# EAGLE design MainPCB_E (EAGLE 9.6.2)
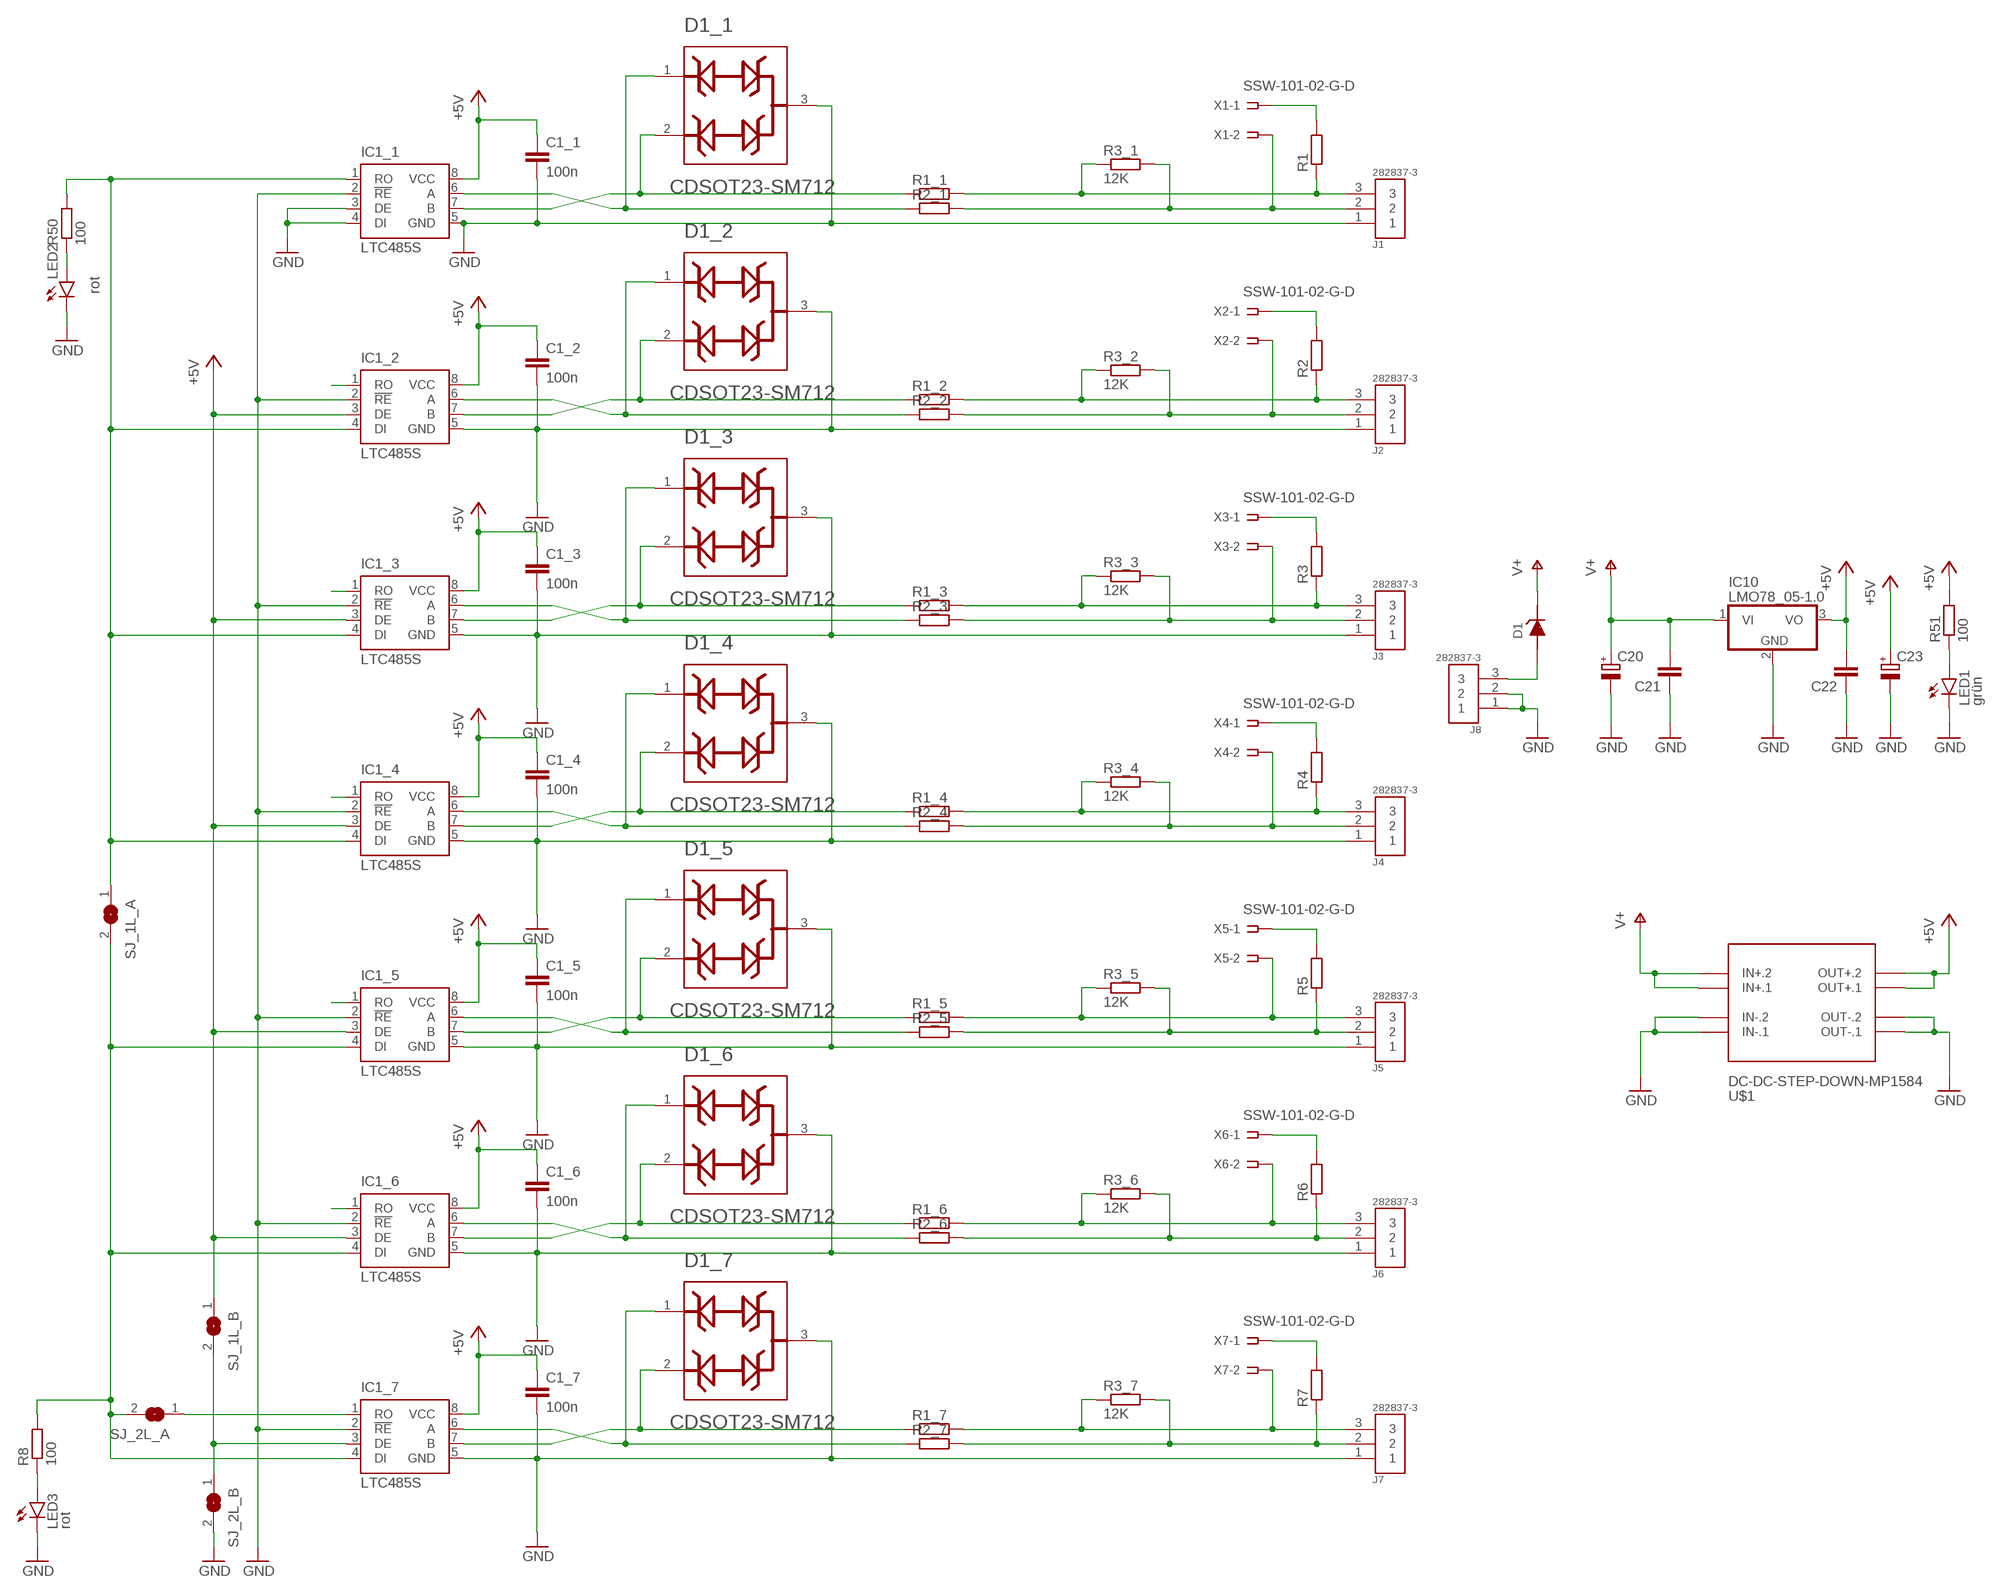
[diagram p0: schematic, sheet 1]

## Parts
C1_1  100n  C-EUC0603K  [C0603K]
C1_2  100n  C-EUC0603K  [C0603K]
C1_3  100n  C-EUC0603K  [C0603K]
C1_4  100n  C-EUC0603K  [C0603K]
C1_5  100n  C-EUC0603K  [C0603K]
C1_6  100n  C-EUC0603K  [C0603K]
C1_7  100n  C-EUC0603K  [C0603K]
C20  CPOL-EUE5-8.5  [E5-8,5]
C21  C-EUC0805K  [C0805K]
C22  C-EUC0805K  [C0805K]
C23  CPOL-EUE5-8.5  [E5-8,5]
D1  ZMM  [MINIMELF]
D1_1  BOURNS_INC._CDSOT23-SM712BOURNS_INC._CDSOT23-SM712_0_1  [BOURNS_INC._CDSOT23-SM712_1]
D1_2  BOURNS_INC._CDSOT23-SM712BOURNS_INC._CDSOT23-SM712_0_1  [BOURNS_INC._CDSOT23-SM712_1]
D1_3  BOURNS_INC._CDSOT23-SM712BOURNS_INC._CDSOT23-SM712_0_1  [BOURNS_INC._CDSOT23-SM712_1]
D1_4  BOURNS_INC._CDSOT23-SM712BOURNS_INC._CDSOT23-SM712_0_1  [BOURNS_INC._CDSOT23-SM712_1]
D1_5  BOURNS_INC._CDSOT23-SM712BOURNS_INC._CDSOT23-SM712_0_1  [BOURNS_INC._CDSOT23-SM712_1]
D1_6  BOURNS_INC._CDSOT23-SM712BOURNS_INC._CDSOT23-SM712_0_1  [BOURNS_INC._CDSOT23-SM712_1]
D1_7  BOURNS_INC._CDSOT23-SM712BOURNS_INC._CDSOT23-SM712_0_1  [BOURNS_INC._CDSOT23-SM712_1]
IC1_1  LTC485S  [SOIC8]
IC1_2  LTC485S  [SOIC8]
IC1_3  LTC485S  [SOIC8]
IC1_4  LTC485S  [SOIC8]
IC1_5  LTC485S  [SOIC8]
IC1_6  LTC485S  [SOIC8]
IC1_7  LTC485S  [SOIC8]
IC10  LMO78_05-1.0  7815TV  [TO220V]
J1  282837-3  [TE_282837-3]
J2  282837-3  [TE_282837-3]
J3  282837-3  [TE_282837-3]
J4  282837-3  [TE_282837-3]
J5  282837-3  [TE_282837-3]
J6  282837-3  [TE_282837-3]
J7  282837-3  [TE_282837-3]
J8  282837-3  [TE_282837-3]
LED1  grün  LED5MM  [LED5MM]
LED2  rot  LED5MM  [LED5MM]
LED3  rot  LED5MM  [LED5MM]
R1  R-EU_R1206  [R1206]
R1_1  R-EU_R0805  [R0805]
R1_2  R-EU_R0805  [R0805]
R1_3  R-EU_R0805  [R0805]
R1_4  R-EU_R0805  [R0805]
R1_5  R-EU_R0805  [R0805]
R1_6  R-EU_R0805  [R0805]
R1_7  R-EU_R0805  [R0805]
R2  R-EU_R1206  [R1206]
R2_1  R-EU_R0805  [R0805]
R2_2  R-EU_R0805  [R0805]
R2_3  R-EU_R0805  [R0805]
R2_4  R-EU_R0805  [R0805]
R2_5  R-EU_R0805  [R0805]
R2_6  R-EU_R0805  [R0805]
R2_7  R-EU_R0805  [R0805]
R3  R-EU_R1206  [R1206]
R3_1  12K  R-EU_R0603  [R0603]
R3_2  12K  R-EU_R0603  [R0603]
R3_3  12K  R-EU_R0603  [R0603]
R3_4  12K  R-EU_R0603  [R0603]
R3_5  12K  R-EU_R0603  [R0603]
R3_6  12K  R-EU_R0603  [R0603]
R3_7  12K  R-EU_R0603  [R0603]
R4  R-EU_R1206  [R1206]
R5  R-EU_R1206  [R1206]
R6  R-EU_R1206  [R1206]
R7  R-EU_R1206  [R1206]
R8  100  R-EU_R0603  [R0603]
R50  100  R-EU_R0603  [R0603]
R51  100  R-EU_R0603  [R0603]
SJ_1L_A  SJ  [SJ]
SJ_1L_B  SJ  [SJ]
SJ_2L_A  SJ  [SJ]
SJ_2L_B  SJ  [SJ]
U$1  DC-DC-STEP-DOWN-MP1584  [DC-DC-STEP-DOWN-MP1584]
X1  SSW-101-02-G-D  [SSW-101-02-G-D]
X2  SSW-101-02-G-D  [SSW-101-02-G-D]
X3  SSW-101-02-G-D  [SSW-101-02-G-D]
X4  SSW-101-02-G-D  [SSW-101-02-G-D]
X5  SSW-101-02-G-D  [SSW-101-02-G-D]
X6  SSW-101-02-G-D  [SSW-101-02-G-D]
X7  SSW-101-02-G-D  [SSW-101-02-G-D]

## Nets
+5V: C1_1.1 C1_2.1 C1_3.1 C1_4.1 C1_5.1 C1_6.1 C1_7.1 C22.2 C23.+ IC1_1.8(VCC) IC1_2.3(DE) IC1_2.8(VCC) IC1_3.3(DE) IC1_3.8(VCC) IC1_4.3(DE) IC1_4.8(VCC) IC1_5.3(DE) IC1_5.8(VCC) IC1_6.3(DE) IC1_6.8(VCC) IC1_7.8(VCC) IC10.3(VO) R51.2 SJ_1L_B.1 U$1.OUT+.1 U$1.OUT+.2
GND: C1_1.2 C1_2.2 C1_3.2 C1_4.2 C1_5.2 C1_6.2 C1_7.2 C20.- C21.1 C22.1 C23.- D1_1.3 D1_2.3 D1_3.3 D1_4.3 D1_5.3 D1_6.3 D1_7.3 IC1_1.2(!RE) IC1_1.3(DE) IC1_1.4(DI) IC1_1.5(GND) IC1_2.2(!RE) IC1_2.5(GND) IC1_3.2(!RE) IC1_3.5(GND) IC1_4.2(!RE) IC1_4.5(GND) IC1_5.2(!RE) IC1_5.5(GND) IC1_6.2(!RE) IC1_6.5(GND) IC1_7.2(!RE) IC1_7.5(GND) IC10.2(GND) J1.1 J2.1 J3.1 J4.1 J5.1 J6.1 J7.1 J8.1 J8.2 LED1.K(C) LED2.K(C) LED3.K(C) SJ_2L_B.2 U$1.IN-.1 U$1.IN-.2 U$1.OUT-.1 U$1.OUT-.2
N$1: R7.2 X7.1
N$2: R6.2 X6.1
N$3: LED3.A R8.1
N$4: R5.2 X5.1
N$5: D1_1.2 IC1_1.7(B) R1_1.1
N$6: IC1_7.3(DE) SJ_1L_B.2 SJ_2L_B.1
N$7: IC1_1.1(RO) IC1_2.4(DI) IC1_3.4(DI) IC1_4.4(DI) R50.2 SJ_1L_A.1
N$8: J1.3 R1.1 R1_1.2 R3_1.1
N$9: J1.2 R2_1.2 R3_1.2 X1.2
N$10: D1_1.1 IC1_1.6(A) R2_1.1
N$11: R4.2 X4.1
N$12: R3.2 X3.1
N$13: R2.2 X2.1
N$14: D1_2.2 IC1_2.7(B) R1_2.1
N$15: IC1_2.1(RO)
N$16: J2.3 R1_2.2 R2.1 R3_2.1
N$17: J2.2 R2_2.2 R3_2.2 X2.2
N$18: IC1_7.1(RO) SJ_2L_A.1
N$19: D1_2.1 IC1_2.6(A) R2_2.1
N$20: R1.2 X1.1
N$21: D1_3.2 IC1_3.7(B) R1_3.1
N$22: IC1_3.1(RO)
N$23: J3.3 R1_3.2 R3.1 R3_3.1
N$24: J3.2 R2_3.2 R3_3.2 X3.2
N$25: D1_3.1 IC1_3.6(A) R2_3.1
N$26: J4.3 R1_4.2 R3_4.1 R4.1
N$27: J4.2 R2_4.2 R3_4.2 X4.2
N$28: IC1_5.4(DI) IC1_6.4(DI) IC1_7.4(DI) R8.2 SJ_1L_A.2 SJ_2L_A.2
N$29: J5.3 R1_5.2 R3_5.1 X5.2
N$30: J5.2 R2_5.2 R3_5.2 R5.1
N$31: J6.3 R1_6.2 R3_6.1 X6.2
N$32: J6.2 R2_6.2 R3_6.2 R6.1
N$33: J7.3 R1_7.2 R3_7.1 X7.2
N$34: J7.2 R2_7.2 R3_7.2 R7.1
N$35: D1_5.2 IC1_5.7(B) R1_5.1
N$36: IC1_5.1(RO)
N$37: D1.A J8.3
N$39: LED1.A R51.1
N$40: LED2.A R50.1
N$41: D1_5.1 IC1_5.6(A) R2_5.1
N$43: D1_6.2 IC1_6.7(B) R1_6.1
N$44: IC1_6.1(RO)
N$47: D1_6.1 IC1_6.6(A) R2_6.1
N$55: D1_4.2 IC1_4.7(B) R1_4.1
N$56: IC1_4.1(RO)
N$59: D1_4.1 IC1_4.6(A) R2_4.1
N$67: D1_7.2 IC1_7.7(B) R1_7.1
N$71: D1_7.1 IC1_7.6(A) R2_7.1
V+: C20.+ C21.2 D1.C(K) IC10.1(VI) U$1.IN+.1 U$1.IN+.2

## Library data of the parts
C1_1-C1_7 C21 C22 = rcl:C-EU: CAPACITOR, European symbol; SPICEPREFIX: C
C20 C23 = rcl:CPOL-EU: POLARIZED CAPACITOR, European symbol; SPICEPREFIX: C
D1 = ct_Discrete:ZMM: Zener Diode, Minimelf
D1_1-D1_7 = Bourns Inc. - CDSOT23-SM712:BOURNS_INC._CDSOT23-SM712: 26V, 14V Clamp 17A (8/20µs) Ipp Tvs Diode Surface Mount SOT-23-3; AUTOMOTIVE: No; BREAKDOWN_VOLTAGE: 7.5V; CAPACITANCE: 75pF; CENTROID_NOT_SPECIFIED: No; CLAMPING_VOLTAGE: 26V; DATASHEET: https://www.bourns.com/docs/Product-Datasheets/CDSOT23-SM712.pdf; DEVICE_CLASS_L1: Circuit Protection; DEVICE_CLASS_L2: TVS Diodes; DEVICE_CLASS_L3: unset; DIGIKEY_DESCRIPTION: DIODE TVS DIODE 7V/12V 14V/26V SOT23-3; DIGIKEY_PART_NUMBER: CDSOT23-SM712CT-ND; DIRECTION: Bidirectional; FOOTPRINT_PARAMETERS_1: {"fp_type":"SOT23","params":{"N":{"default":"3","long name":"Number of leads","type":"multichoice","short name":"N"},"A":{"nom":false,"long name":"Height","min":890000,"max":1170000,"short name":"A","type":"measurement"},"A1":{"nom":false,"long name":"Package clearance","min":50000,"max":150000,"short name":"A1","type":"measurement"},"A2":{"nom":false,"long name":"Package height","min":false,"max":1120000,"short name":"A2","type":"measurement"},"D":{"nom":false,"long name":"Package length","min":2800000,"max":3000000,"short name":"D","type":"measurement"},"E":{"nom":false,"long name":"Width /w leads","min":2100000,"max":2490000,"short name":"E","type":"measurement"},"E1":{"nom":false,"long name":"Package width","min":1200000,"max":1400000,"short name":"E1","type":"measurement"},"B":{"nom":false,"long name":"Lead width","min":300000,"max":500000,"short name":"B","type":"measurement"},"C":{"nom":false,"long name":"Lead thickness","min":80000,"max":200000,"short name":"C","type":"measurement"},"L":{"nom":false,"long name":"Lead foot length","min":400000,"max":580000,"short name":"L","type":"measurement"},"e":{"nom":950000,"long name":"Lead pitch","min":null,"max":null,"short name":"e","type":"measurement"},"PHI":{"nom":false,"long name":"Lead angle","min":0,"max":8,"short name":"PHI","type":"measurement"},"offset x":{"nom":0,"long name":"X Center offset","min":null,"max":null,"short name":"offset x","type":"measurement"},"offset y":{"nom":0,"long name":"Y Center offset","min":null,"max":null,"short name":"offset y","type":"measurement"},"LS":{"default":"Rounded rectangle","long name":"Land shape","type":"multichoice","short name":"LS"},"LS1":{"default":"Rectangle","long name":"Land shape (Pin 1)","type":"multichoice","short name":"LS1"},"solder toe":{"nom":550000,"long name":"Solder fillet (toe)","min":null,"max":null,"short name":"solder toe","type":"fixedmeasurement"},"solder heel":{"nom":450000,"long name":"Solder fillet (heel)","min":null,"max":null,"short name":"solder heel","type":"fixedmeasurement"},"solder side":{"nom":50000,"long name":"Solder fillet (side)","min":null,"max":null,"short name":"solder side","type":"fixedmeasurement"},"courtyard":{"nom":500000,"long name":"Courtyard","min":null,"max":null,"short name":"courtyard","type":"fixedmeasurement"},"SF":{"default":"A","long name":"Packing level","type":"multichoiceparent","short name":"SF","help":"http://support.upverter.com/customer/portal/articles/978783-what-is-a-footprint-packing-level","children":["solder toe","solder heel","solder side","courtyard"]}}}; FOOTPRINT_PARAMETERS_2: {"fp_type":"SOT23","params":{"N":{"default":"3","long name":"Number of leads","type":"multichoice","short name":"N"},"A":{"nom":false,"long name":"Height","min":890000,"max":1170000,"short name":"A","type":"measurement"},"A1":{"nom":false,"long name":"Package clearance","min":50000,"max":150000,"short name":"A1","type":"measurement"},"A2":{"nom":false,"long name":"Package height","min":false,"max":1120000,"short name":"A2","type":"measurement"},"D":{"nom":false,"long name":"Package length","min":2800000,"max":3000000,"short name":"D","type":"measurement"},"E":{"nom":false,"long name":"Width /w leads","min":2100000,"max":2490000,"short name":"E","type":"measurement"},"E1":{"nom":false,"long name":"Package width","min":1200000,"max":1400000,"short name":"E1","type":"measurement"},"B":{"nom":false,"long name":"Lead width","min":300000,"max":500000,"short name":"B","type":"measurement"},"C":{"nom":false,"long name":"Lead thickness","min":80000,"max":200000,"short name":"C","type":"measurement"},"L":{"nom":false,"long name":"Lead foot length","min":400000,"max":580000,"short name":"L","type":"measurement"},"e":{"nom":950000,"long name":"Lead pitch","min":null,"max":null,"short name":"e","type":"measurement"},"PHI":{"nom":false,"long name":"Lead angle","min":0,"max":8,"short name":"PHI","type":"measurement"},"offset x":{"nom":0,"long name":"X Center offset","min":null,"max":null,"short name":"offset x","type":"measurement"},"offset y":{"nom":0,"long name":"Y Center offset","min":null,"max":null,"short name":"offset y","type":"measurement"},"LS":{"default":"Rounded rectangle","long name":"Land shape","type":"multichoice","short name":"LS"},"LS1":{"default":"Rectangle","long name":"Land shape (Pin 1)","type":"multichoice","short name":"LS1"},"solder toe":{"nom":350000,"long name":"Solder fillet (toe)","min":null,"max":null,"short name":"solder toe","type":"fixedmeasurement"},"solder heel":{"nom":350000,"long name":"Solder fillet (heel)","min":null,"max":null,"short name":"solder heel","type":"fixedmeasurement"},"solder side":{"nom":30000,"long name":"Solder fillet (side)","min":null,"max":null,"short name":"solder side","type":"fixedmeasurement"},"courtyard":{"nom":250000,"long name":"Courtyard","min":null,"max":null,"short name":"courtyard","type":"fixedmeasurement"},"SF":{"default":"B","long name":"Packing level","type":"multichoiceparent","short name":"SF","help":"http://support.upverter.com/customer/portal/articles/978783-what-is-a-footprint-packing-level","children":["solder toe","solder heel","solder side","courtyard"]}}}; FOOTPRINT_PARAMETERS_3: {"fp_type":"SOT23","params":{"N":{"default":"3","long name":"Number of leads","type":"multichoice","short name":"N"},"A":{"nom":false,"long name":"Height","min":890000,"max":1170000,"short name":"A","type":"measurement"},"A1":{"nom":false,"long name":"Package clearance","min":50000,"max":150000,"short name":"A1","type":"measurement"},"A2":{"nom":false,"long name":"Package height","min":false,"max":1120000,"short name":"A2","type":"measurement"},"D":{"nom":false,"long name":"Package length","min":2800000,"max":3000000,"short name":"D","type":"measurement"},"E":{"nom":false,"long name":"Width /w leads","min":2100000,"max":2490000,"short name":"E","type":"measurement"},"E1":{"nom":false,"long name":"Package width","min":1200000,"max":1400000,"short name":"E1","type":"measurement"},"B":{"nom":false,"long name":"Lead width","min":300000,"max":500000,"short name":"B","type":"measurement"},"C":{"nom":false,"long name":"Lead thickness","min":80000,"max":200000,"short name":"C","type":"measurement"},"L":{"nom":false,"long name":"Lead foot length","min":400000,"max":580000,"short name":"L","type":"measurement"},"e":{"nom":950000,"long name":"Lead pitch","min":null,"max":null,"short name":"e","type":"measurement"},"PHI":{"nom":false,"long name":"Lead angle","min":0,"max":8,"short name":"PHI","type":"measurement"},"offset x":{"nom":0,"long name":"X Center offset","min":null,"max":null,"short name":"offset x","type":"measurement"},"offset y":{"nom":0,"long name":"Y Center offset","min":null,"max":null,"short name":"offset y","type":"measurement"},"LS":{"default":"Rounded rectangle","long name":"Land shape","type":"multichoice","short name":"LS"},"LS1":{"default":"Rectangle","long name":"Land shape (Pin 1)","type":"multichoice","short name":"LS1"},"solder toe":{"nom":150000,"long name":"Solder fillet (toe)","min":null,"max":null,"short name":"solder toe","type":"fixedmeasurement"},"solder heel":{"nom":250000,"long name":"Solder fillet (heel)","min":null,"max":null,"short name":"solder heel","type":"fixedmeasurement"},"solder side":{"nom":10000,"long name":"Solder fillet (side)","min":null,"max":null,"short name":"solder side","type":"fixedmeasurement"},"courtyard":{"nom":100000,"long name":"Courtyard","min":null,"max":null,"short name":"courtyard","type":"fixedmeasurement"},"SF":{"default":"C","long name":"Packing level","type":"multichoiceparent","short name":"SF","help":"http://support.upverter.com/customer/portal/articles/978783-what-is-a-footprint-packing-level","children":["solder toe","solder heel","solder side","courtyard"]}}}; FOOTPRINT_VARIANT_NAME_0: Recommended_Land_Pattern; FOOTPRINT_VARIANT_NAME_1: IPC_A; FOOTPRINT_VARIANT_NAME_2: IPC_B; FOOTPRINT_VARIANT_NAME_3: IPC_C; HEIGHT: 1.17mm; IPC_LAND_PATTERN_NAME: SOT95P229X103-3; LEAD_FREE: Yes; MF: Bourns Inc.; MFG_PACKAGE_IDENT: SOT23; MFG_PACKAGE_IDENT_DATE: 0; MFG_PACKAGE_IDENT_REV: 0; MOUSER_DESCRIPTION: Transient Voltage Suppressor, TVS, CDSOT23 Series, Unidirectional, 12 V, SOT-23, 3, 13.3 V; MOUSER_PART_NUMBER: 652-CDSOT23-SM712; MPN: CDSOT23-SM712; NUMBER_OF_CHANNELS: 2; PACKAGE: SOT23-3; PEAK_PULSE_CURRENT: 17A; PEAK_PULSE_POWER: 400W; PREFIX: D; REVERSE_STANDOFF_VOLTAGE: 12V; ROHS: Yes; STANDOFF_HEIGHT: 0.05mm; TEMPERATURE_RANGE_HIGH: +150°C; TEMPERATURE_RANGE_LOW: -55°C; VERIFICATION_VERSION: 0.0.0.3
IC1_1-IC1_7 = linear-technology:LTC485: Low Power RS485 Interface Transceiver Source: http://www.linear.com/pc/downloadDocument.do?navId=H0,C1,C1007,C1017,P2064,D1718; OC_FARNELL: unknown; OC_NEWARK: unknown
IC10 = linear:78*: Positive VOLTAGE REGULATOR Source: http://cache.national.com/ds/LM/LM78L05.pdf http://www.fairchildsemi.com/ds/LM/LM7805.pdf
J1-J8 = 282837-3:282837-3: TERMI-BLOK PCB MOUNT 3P; MANUFACTURER: TE CONNECTIVITY; PARTREV: H; STANDARD: Manufacturer Recommendations
LED1-LED3 = led:LED: LED OSRAM: - CHIPLED LG R971, LG N971, LY N971, LG Q971, LY Q971, LO R971, LY R971 LH N974, LH R974 LS Q976, LO Q976, LY Q976 LO Q996 - Hyper CHIPLED LW Q18S LB Q993, LB Q99A, LB R99A - SideLED LS A670, LO A670, LY A670, LG A670, LP A670 LB A673, LV A673, LT A673, LW A673 LH A674 LY A675 LS A676, LA A676, LO A676, LY A676, LW A676 LS A679, LY A679, LG A679 - Hyper Micro SIDELED® LS Y876, LA Y876, LO Y876, LY Y876 LT Y87S - SmartLED LW L88C, LW L88S LB L89C, LB L89S, LG L890 LS L89K, LO L89K, LY L89K LS L896, LA L896, LO L896, LY L896 - TOPLED LS T670, LO T670, LY T670, LG T670, LP T670 LSG T670, LSP T670, LSY T670, LOP T670, LYG T670 LG T671, LOG T671, LSG T671 LB T673, LV T673, LT T673, LW T673 LH T674 LS T676, LA T676, LO T676, LY T676, LB T676, LH T676, LSB T676, LW T676 LB T67C, LV T67C, LT T67C, LS T67K, LO T67K, LY T67K, LW E67C LS E67B, LA E67B, LO E67B, LY E67B, LB E67C, LV E67C, LT E67C LW T67C LS T679, LY T679, LG T679 LS T770, LO T770, LY T770, LG T770, LP T770 LB T773, LV T773, LT T773, LW T773 LH T774 LS E675, LA E675, LY E675, LS T675 LS T776, LA T776, LO T776, LY T776, LB T776 LHGB T686 LT T68C, LB T68C - Hyper Mini TOPLED® LB M676 - Mini TOPLED Santana® LG M470 LS M47K, LO M47K, LY M47K Source: http://www.osram.convergy.de LUXEON: - LUMILED® LXK2-PW12-R00, LXK2-PW12-S00, LXK2-PW14-U00, LXK2-PW14-V00 LXK2-PM12-R00, LXK2-PM12-S00, LXK2-PM14-U00 LXK2-PE12-Q00, LXK2-PE12-R00, LXK2-PE12-S00, LXK2-PE14-T00, LXK2-PE14-U00 LXK2-PB12-K00, LXK2-PB12-L00, LXK2-PB12-M00, LXK2-PB14-N00, LXK2-PB14-P00, LXK2-PB14-Q00 LXK2-PR12-L00, LXK2-PR12-M00, LXK2-PR14-Q00, LXK2-PR14-R00 LXK2-PD12-Q00, LXK2-PD12-R00, LXK2-PD12-S00 LXK2-PH12-R00, LXK2-PH12-S00 LXK2-PL12-P00, LXK2-PL12-Q00, LXK2-PL12-R00 Source: www.luxeon.com KINGBRIGHT: KA-3528ASYC Source: www.kingbright.com
R1 R1_1-R1_7 R2 R2_1-R2_7 R3 R3_1-R3_7 R4-R8 R50 R51 = rcl:R-EU_: RESISTOR, European symbol; SPICEPREFIX: R
SJ_1L_A SJ_1L_B SJ_2L_A SJ_2L_B = jumper:SJ: SMD solder JUMPER
U$1 = diy-modules:DC-DC-STEP-DOWN-MP1584: DC/DC Step-Down Regulator based on MP1584 chip MP1584 datasheet available here: http://www.haoyuelectronics.com/Attachment/MP1584/MP1584.pdf Click here to find device on ebay.com <http://www.ebay.com/sch/mp1584+module>
X1-X7 = con-samtec:SSW-101-02-G: THROUGH-HOLE .025" SQ POST SOCKET Source: Samtec SSW.pdf; MF: Samtec Inc.; MPN: SSW-101-02-G-D; OC_FARNELL: unknown; OC_NEWARK: 82P1456

## Board
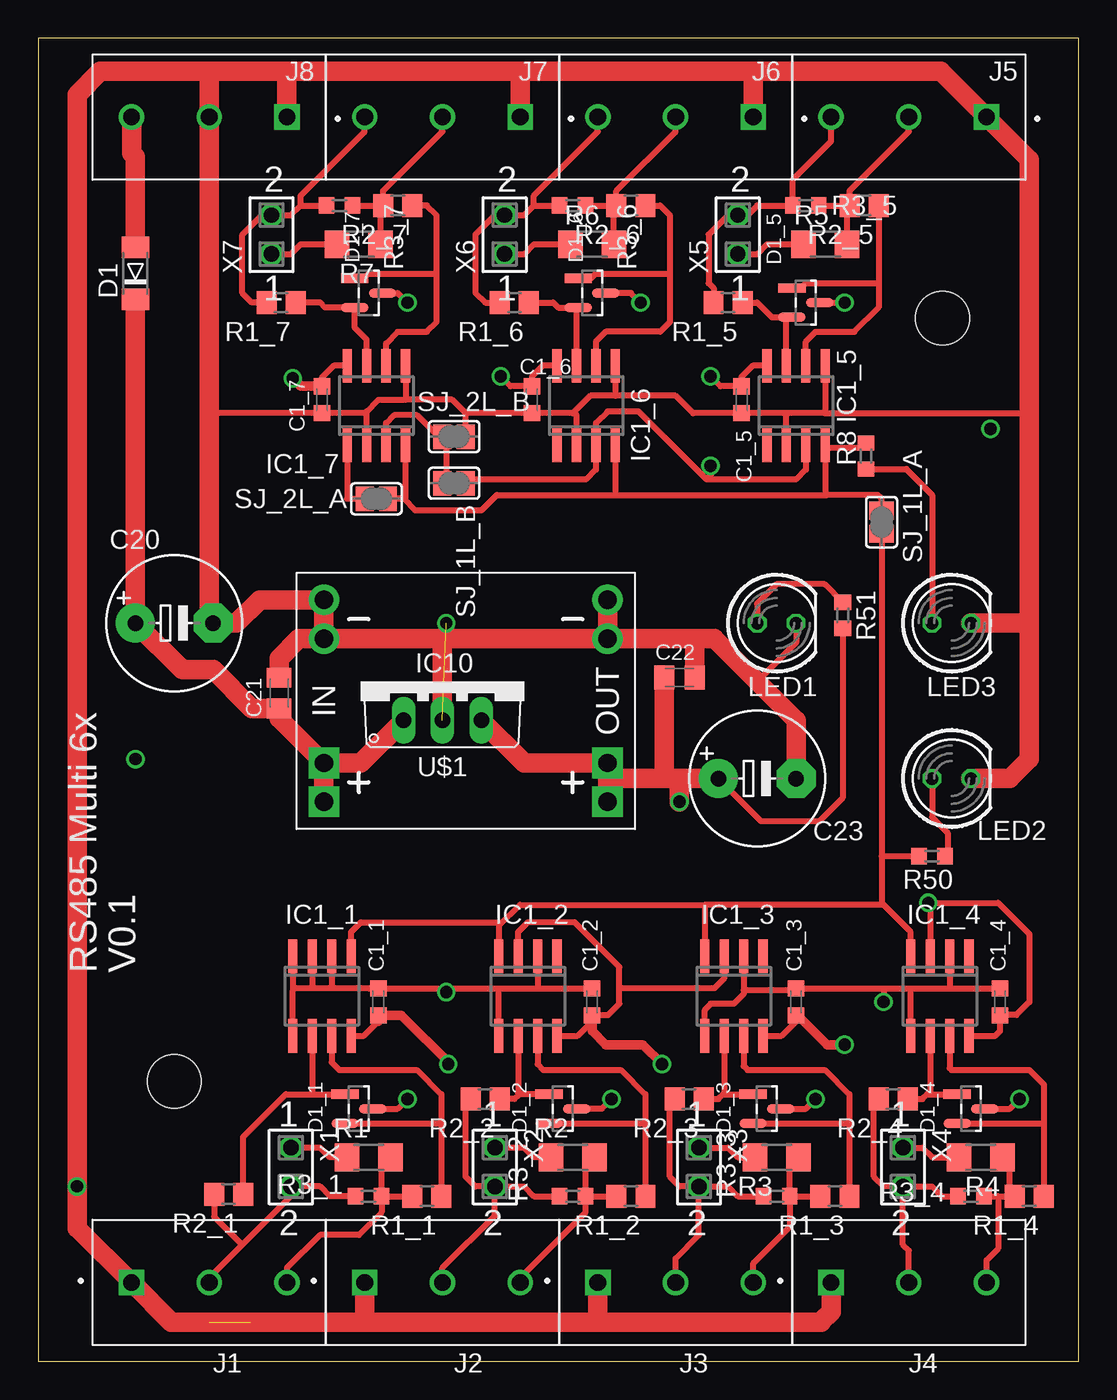
[diagram p1: board, top side]
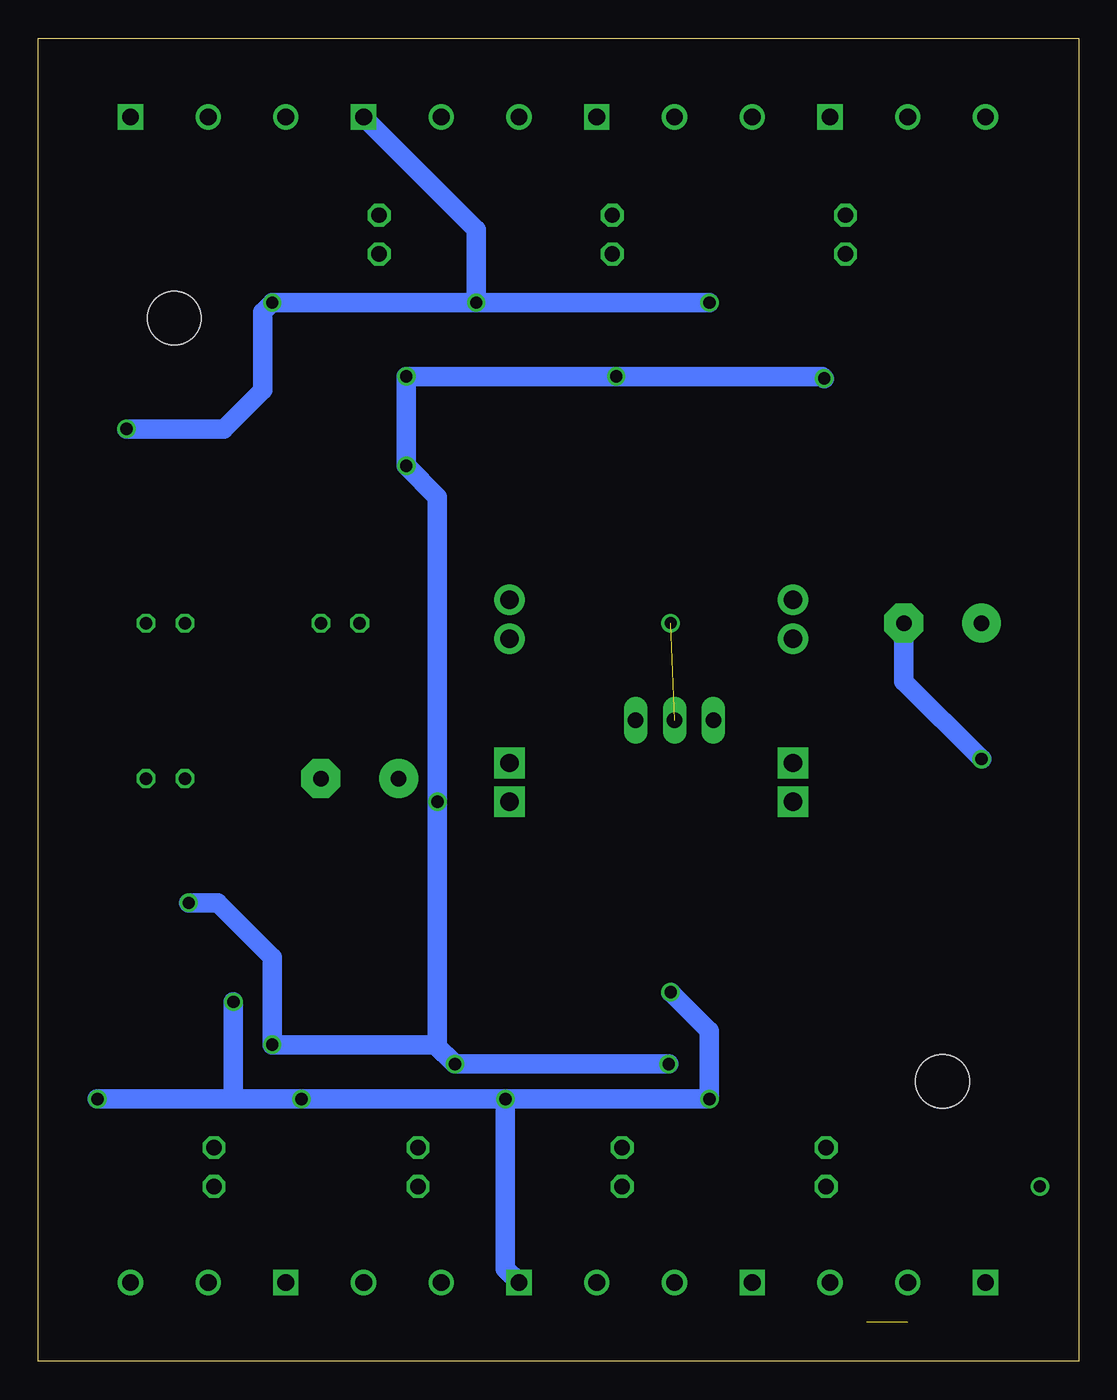
[diagram p2: board, bottom side, seen from below]

Size 68 x 86.5 mm. Coordinates in mm from the lower left corner, seen from the top.
Outline: 0,0 68,0 68,86.5 0,86.5 0,0
Copper layers (1*16): Top 0.018mm / dielectric 1.55mm / Bottom 0.018mm
Design rules "Multi-CB_2L_100µm-Tracks_OL35µm": minimum track width 0.1mm, minimum drill 0.2mm, track to track 0.1mm, track to pad 0.1mm, pad to pad 0.1mm, via to via 0.1mm, smd to smd 0mil, copper to edge 0.2mm, drill to drill 0.2mm, minimum pad ring 0.125mm, minimum via ring 0.1mm, stop-mask expansion 2mil, vias tented up to drill 0.45mm, thermal gap 0.2mm
Holes 3.5 mm at 8.9,18.3 59.1,68.2

### Footprints (pad centres in the part's own frame; a part is rotated, then mirrored left to right if it is on the bottom)
C0603K = smd 1.05 x 1.08: 1 -0.875,0; 2 0.875,0
E5-8,5 = drill 1.016 pad 2.54: + -2.54,0 | drill 1.016 pad 2.54 octagon: - 2.54,0
C0805K = smd 1.3 x 1.6: 1 -1,0; 2 1,0
MINIMELF = smd 1.4 x 1.8: A 1.7,0; C -1.7,0
BOURNS_INC._CDSOT23-SM712_1 = smd 1.781 x 0.612: 1 -0.908,0.95; 2 -0.908,-0.95; 3 0.908,0
SOIC8 = smd 0.6 x 2.2: 1 -1.905,-2.6; 2 -0.635,-2.6; 3 0.635,-2.6; 4 1.905,-2.6; 5 1.905,2.6; 6 0.635,2.6; 7 -0.635,2.6; 8 -1.905,2.6
TO220V = drill 1.016 long: 1 -2.54,-2.54; 2 0,-2.54; 3 2.54,-2.54
TE_282837-3 = drill 1.1 square: 1 -5.08,0 | drill 1.1: 2 0,0; 3 5.08,0
LED5MM = drill 0.813 octagon: A -1.27,0; K 1.27,0
R1206 = smd 1.6 x 1.803: 1 -1.422,0; 2 1.422,0
R0805 = smd 1.3 x 1.5: 1 -0.95,0; 2 0.95,0
R0603 = smd 1 x 1.1: 1 -0.85,0; 2 0.85,0
SJ = smd 1.168 x 1.6: 1 -0.762,0; 2 0.762,0
DC-DC-STEP-DOWN-MP1584 = drill 1.2 pad 2 square: IN+.1 -9.271,-4.064; IN+.2 -9.271,-6.604; OUT+.1 9.271,-4.064; OUT+.2 9.271,-6.604 | drill 1.2 pad 2: IN-.1 -9.271,6.604; IN-.2 -9.271,4.064; OUT-.1 9.271,6.604; OUT-.2 9.271,4.064
SSW-101-02-G-D = drill 1 pad 1.5 octagon: 1 0,-1.27; 2 0,1.27

### Placement (x,y rotation side)
C1_1  22.23,23.5 90 top
C1_2  36.2,23.5 90 top
C1_3  49.53,23.5 90 top
C1_4  62.87,23.5 90 top
C1_5  45.97,62.87 270 top
C1_6  32.26,62.87 270 top
C1_7  18.54,62.87 270 top
C20  8.89,48.26 0 top
C21  15.75,43.69 270 top
C22  41.91,44.7 180 top
C23  46.99,38.1 0 top
D1  6.35,71.12 90 top
D1_1  20.95,16.51 0 top
D1_2  34.29,16.51 0 top
D1_3  47.62,16.51 0 top
D1_4  60.96,16.51 0 top
D1_5  50.16,69.22 0 top
D1_6  36.2,69.85 0 top
D1_7  21.59,69.85 0 top
IC1_1  18.54,23.88 180 top
IC1_2  32,23.88 180 top
IC1_3  45.47,23.88 180 top
IC1_4  58.93,23.88 180 top
IC1_5  49.53,62.48 0 top
IC1_6  35.81,62.48 0 top
IC1_7  22.1,62.48 0 top
IC10  26.42,44.45 0 top
J1  11.18,5.15 0 top
J2  26.42,5.15 0 top
J3  41.66,5.15 0 top
J4  56.9,5.15 0 top
J5  56.9,81.35 180 top
J6  41.66,81.35 180 top
J7  26.42,81.35 180 top
J8  11.18,81.35 180 top
LED1  48.26,48.26 0 top
LED2  59.69,38.1 0 top
LED3  59.69,48.26 0 top
R1  21.59,13.34 180 top
R1_1  25.4,10.79 180 top
R1_2  38.73,10.79 180 top
R1_3  52.07,10.79 180 top
R1_4  64.77,10.79 180 top
R1_5  45.09,69.22 180 top
R1_6  31.11,69.22 180 top
R1_7  15.88,69.22 180 top
R2  34.92,13.34 180 top
R2_1  12.45,10.92 180 top
R2_2  29.21,17.14 180 top
R2_3  42.55,17.14 180 top
R2_4  55.88,17.14 180 top
R2_5  53.98,75.56 180 top
R2_6  38.73,75.56 180 top
R2_7  23.5,75.56 180 top
R3  48.26,13.34 180 top
R3_1  21.59,10.79 180 top
R3_2  34.92,10.79 180 top
R3_3  48.26,10.79 180 top
R3_4  60.96,10.79 180 top
R3_5  50.16,75.56 0 top
R3_6  34.92,75.56 0 top
R3_7  19.68,75.56 0 top
R4  61.59,13.34 180 top
R5  51.44,73.03 180 top
R6  36.2,73.03 180 top
R7  20.95,73.03 180 top
R8  54.1,59.18 90 top
R50  58.42,33.02 180 top
R51  52.58,48.77 270 top
SJ_1L_A  55.12,54.86 90 top
SJ_1L_B  27.18,57.4 180 top
SJ_2L_A  22.1,56.39 0 top
SJ_2L_B  27.18,60.45 0 top
U$1  27.94,43.18 0 top
X1  16.51,12.7 180 top
X2  29.84,12.7 180 top
X3  43.18,12.7 180 top
X4  56.52,12.7 180 top
X5  45.72,73.66 0 top
X6  30.48,73.66 0 top
X7  15.24,73.66 0 top

### Tracks (layer width: path | path; a pad name or v marks a point on that pad's centre or on a via)
+5V  (via drill 0.8)
  Top 0.406: 22.2,22.64 C1_1.1 | 49.51,22.64 C1_3.1 49.53,22.23 48.58,21.28 IC1_3.8 | 46,63.72 C1_5.1 | 32.28,63.72 C1_6.1 | IC1_5.3 50.16,58.29 49.53,57.66 43.81,57.66 | IC1_2.3 31.37,28.07 32,28.7 35.05,28.7 37.97,25.78 37.97,24.38 | SJ_1L_B.1 28.19,57.66 35.81,57.66 36.45,58.29 IC1_6.3 36.45,61.34 37.21,62.1 39.24,62.1 43.69,57.66 43.81,57.66 | IC1_4.3 58.29,29.84 v58.17,29.97 62.74,29.97 64.77,27.94 64.77,23.5 63.92,22.64 62.84,22.64 C1_4.1 62.87,21.59 62.55,21.28 IC1_4.8 | R51.2 52.58,36.83 51.05,35.31 47.24,35.31 C23.+ | IC1_1.8 21.28,21.28 22.23,22.23 | 37.97,24.38 37.97,23.37 37.23,22.62 C1_2.1 | IC1_2.8 35.25,21.28 36.2,22.23 | IC1_7.8 19.3,65.08 18.54,64.33 C1_7.1 | C1_6.1 30.88,63.74 v30.23,64.39 | C1_5.1 44.59,63.74 v43.94,64.39 | IC1_5.8 46.68,65.08 45.97,64.38 C1_5.1 | IC1_6.8 32.97,65.08 32.26,64.38 C1_6.1 | v43.94,58.55 43.94,57.91 43.81,57.78 43.81,57.66 | IC1_3.3 44.83,25.02 44.2,24.38 37.97,24.38
  Top 0.61: 22.23,22.23 C1_1.1 23.73,22.62 26.92,19.43 v26.8,19.43 | v40.77,19.43 39.5,20.7 37.08,20.7 36.2,21.59 36.2,22.23 C1_2.1 | v52.7,20.7 51.56,20.7 49.64,22.62 C1_3.1 | C1_7.1 17.14,63.74 17.14,63.75 v16.64,64.26
  Top 1.27: 37.21,38.1 U$1.OUT+.1 31.75,39.12 IC10.3 | 37.21,38.1 U$1.OUT+.2 37.21,37.85 | C23.+ 41.91,38.1 | C22.2 40.91,38.1 | 40.91,38.1 37.21,38.1 | v41.91,36.58 41.91,38.1 | 40.91,38.1 41.91,38.1
  Bottom 1.27: v40.77,19.43 41.91,20.57 v41.91,36.58 41.91,56.52 v43.94,58.55 v43.94,64.39 v30.23,64.39 16.76,64.39 v16.64,64.26 | v40.77,19.43 v26.8,19.43 | v40.77,19.43 42.04,20.7 v52.7,20.7 52.7,26.42 56.26,29.97 v58.17,29.97
GND  (via drill 0.8)  (2 unrouted)
  Top 0.406: 19.05,24.38 21.59,24.38 21.6,24.37 C1_1.2 26.67,24.37 | 19.05,24.38 18.03,24.38 | 18.03,24.38 16.76,24.38 16.64,24.26 | IC1_1.5 16.64,24.26 | IC1_3.5 43.56,22.99 43.94,23.37 45.47,23.37 46.1,24 46.1,24.26 | IC1_5.5 51.44,61.98 | IC1_1.4 16.64,24.26 | IC1_1.3 17.91,24.51 18.03,24.38 | IC1_1.2 19.18,24.51 19.05,24.38 | IC1_5.2 48.9,61.85 49.02,61.98 | LED1.K 49.53,46.99 46.99,44.45 | IC1_6.2 35.18,61.85 35.05,61.98 34.92,61.98 | SJ_2L_B.2 27.94,61.98 | 51.44,61.98 49.02,61.98 | 64.77,62.23 64.52,61.98 51.44,61.98 | 11.57,65.17 11.18,64.77 | C1_3.2 49.29,24.13 | IC1_7.5 24,62.87 | 21.46,62.1 21.35,61.99 C1_7.2 11.19,61.99 11.18,61.98 | 21.46,62.1 22.23,62.87 24,62.87 | IC1_7.2 21.46,62.1 | 27.94,61.98 27.05,62.87 24,62.87 | 34.92,61.98 32.27,61.98 C1_6.2 27.95,61.99 27.94,61.98 | 49.02,61.98 45.99,61.98 C1_5.2 42.8,61.99 41.66,63.13 37.72,63.13 | 37.72,63.13 36.08,63.13 34.92,61.98 | IC1_6.5 37.72,63.13 | IC1_3.2 46.1,24.26 | C1_3.2 49.42,24.26 46.1,24.26 | D1_1.3 23.5,16.51 v24.13,17.14 | v37.47,17.14 36.83,16.51 D1_2.3 | D1_3.3 50.16,16.51 v50.8,17.14 | D1_4.3 63.5,16.51 v64.14,17.14 | C1_3.2 55.24,24.37 | 55.24,24.37 57.15,24.37 | 57.15,24.37 59.69,24.37 | 59.69,24.37 C1_4.2 | IC1_4.2 59.56,24.5 59.69,24.37 | IC1_4.5 57.02,24.24 57.15,24.37 | 55.24,24.37 v55.24,23.5 | 26.67,24.37 30.1,24.37 | 30.1,24.37 32.64,24.37 | 32.64,24.37 C1_2.2 | v26.67,24.13 26.67,24.37 | IC1_2.2 32.64,24.37 | IC1_2.5 30.1,24.37 | D1_7.3 23.5,69.85 v24.13,69.22 | v39.37,69.22 38.73,69.85 D1_6.3 | D1_5.3 v52.7,69.22
  Top 1.27: J4.1 51.82,3.25 51.18,2.61 51.18,2.54 36.58,2.54 | 36.58,2.54 J3.1 | 21.34,2.54 J2.1 | 11.18,2.54 21.34,2.54 | 21.34,2.54 36.58,2.54 | 16.26,84.33 31.5,84.33 | 31.5,84.33 46.74,84.33 | 46.74,84.33 59,84.33 J5.1 64.77,78.56 64.77,62.23 64.77,48.26 | J6.1 46.74,84.33 | J7.1 31.5,84.33 | J8.1 16.26,84.33 | U$1.OUT-.1 U$1.OUT-.2 | 42.91,47.24 44.2,47.24 46.99,44.45 49.53,41.91 C23.- | C22.1 42.91,47.24 | U$1.OUT-.2 26.67,47.24 | 26.67,47.24 U$1.IN-.2 | U$1.IN-.2 U$1.IN-.1 14.48,49.78 12.95,48.26 C20.- 11.18,48.51 11.18,61.98 11.18,64.77 J8.2 11.18,84.07 11.43,84.33 | U$1.IN-.2 17.03,47.24 15.75,45.96 C21.1 | IC10.2 26.42,46.99 26.67,47.24 | 11.43,84.33 4.06,84.33 2.54,82.8 v2.54,11.43 2.54,8.71 J1.1 8.71,2.54 13.84,2.54 | 11.43,84.33 16.26,84.33 | U$1.OUT-.2 42.91,47.24 | 64.77,48.26 64.77,39.37 63.5,38.1 LED2.K | LED3.K 64.77,48.26
  Bottom 1.27: v37.47,17.14 v24.13,17.14 24.13,21.59 v26.67,24.13 | v37.47,17.14 v50.8,17.14 55.24,17.14 | v64.14,17.14 55.24,17.14 | v55.24,23.5 55.24,17.14 | v37.47,17.14 37.47,6.04 J3.1 | v24.13,69.22 v39.37,69.22 | v39.37,69.22 v52.7,69.22 53.34,68.58 53.34,63.5 55.88,60.96 v62.23,60.96 | v39.37,69.22 39.37,73.98 J6.1 | v6.35,39.37 11.43,44.45 C20.-
  other vias: 26.67,48.26
  pour Top (isolate 0.813): 0,86.36 0.76,86.36 0.76,0 0,0
  pour Bottom (isolate 0.813): 0,86.36 0,0.25 0.51,0.25 0.51,86.36
N$1
  Top 0.406: X7.1 16.51,72.39 17.14,73.03 R7.2
N$2
  Top 0.406: X6.1 31.75,72.39 32.38,73.03 R6.2
N$3
  Top 0.406: R8.1 56.73,58.33 58.42,56.64 LED3.A
N$4
  Top 0.406: X5.1 46.99,72.39 47.62,73.03 R5.2
N$5
  Top 0.406: D1_1.2 26.35,15.56 | 26.35,15.56 R1_1.1 | IC1_1.7 19.18,19.56 19.68,19.05 24.77,19.05 26.35,17.46 26.35,15.56
N$6
  Top 0.406: IC1_7.3 22.73,61.34 23.24,61.85 24.77,61.85 26.16,60.45 SJ_2L_B.1 26.67,60.71 26.67,57.66 SJ_1L_B.2
N$7
  Top 0.406: IC1_1.1 20.45,28.07 21.08,28.7 30.1,28.7 30.1,28.45 | 30.1,28.45 IC1_2.4 | 43.56,29.84 IC1_3.4 | IC1_4.4 57.02,28.07 55.24,29.84 | 55.24,29.84 55.12,29.97 55.12,33.02 | 55.24,29.84 43.56,29.84 | SJ_1L_A.1 55.12,33.02 | R50.2 55.12,33.02 | 30.1,28.45 31.5,29.84 43.56,29.84
N$8
  Top 0.406: R3_1.1 R1_1.2 | R3_1.1 22.44,12.76 R1.1 | R3_1.1 22.44,9.74 20.95,8.26 18.41,8.26 16.26,6.1 J1.3
N$9
  Top 0.406: R3_1.2 19.05,10.79 18.41,11.43 X1.2 16.51,10.79 13.34,7.62 | J1.2 11.18,5.46 13.34,7.62 | R2_1.2 11.5,9.46 13.34,7.62
N$10
  Top 0.406: R2_1.1 13.4,14.67 16.19,17.46 17.78,17.46 | 17.78,17.46 D1_1.1 | 17.78,17.46 17.91,17.59 IC1_1.6
N$11
  Top 0.406: X4.1 57.78,13.97 58.42,13.34 R4.2
N$12
  Top 0.406: X3.1 45.09,13.97 45.72,13.34 R3.2
N$13
  Top 0.406: R2.2 32.38,13.34 31.75,13.97 X2.1
N$14
  Top 0.406: IC1_2.7 32.64,19.43 33.02,19.05 38.1,19.05 39.69,17.46 39.69,15.62 | 39.69,15.62 R1_2.1 | D1_2.2 39.62,15.56 39.69,15.62
N$16
  Top 0.406: R3_2.1 35.77,12.76 R2.1 | R3_2.1 R1_2.2 | J2.3 31.5,5.46 35.77,9.74 R3_2.1
N$17
  Top 0.406: X2.2 31.75,11.43 32.38,10.79 R3_2.2 | X2.2 28.57,11.43 27.94,12.06 27.94,16.82 R2_2.2 | J2.2 26.42,6.1 29.84,9.53 X2.2
N$18
  Top 0.406: IC1_7.1 20.19,56.39 SJ_2L_A.1
N$19
  Top 0.406: D1_2.1 31.43,17.46 | 31.43,17.46 31.11,17.14 R2_2.1 | IC1_2.6 31.37,17.52 31.43,17.46
N$20
  Top 0.406: R1.2 19.05,13.34 18.41,13.97 X1.1
N$21
  Top 0.406: 53.02,15.49 R1_3.1 | IC1_3.7 46.1,19.3 46.35,19.05 51.44,19.05 53.02,17.46 53.02,15.49 | D1_3.2 52.95,15.56 53.02,15.49
N$23
  Top 0.406: R3_3.1 49.11,12.76 R3.1 | R3_3.1 R1_3.2 | J3.3 46.74,6.42 49.11,8.79 R3_3.1
N$24
  Top 0.406: X3.2 41.91,11.43 41.27,12.06 41.27,16.82 R2_3.2 | X3.2 45.09,11.43 45.72,10.79 R3_3.2 | J3.2 41.66,6.73 43.18,8.26 X3.2
N$25
  Top 0.406: R2_3.1 44.45,17.14 44.77,17.46 | 44.77,17.46 D1_3.1 | IC1_3.6 44.83,17.53 44.77,17.46
N$26
  Top 0.406: 62.74,10.79 R3_4.1 61.59,10.58 | 62.74,10.79 R1_4.2 63.5,11.12 63.5,12.85 R4.1 | J4.3 61.98,6.6 62.74,7.37 62.74,10.79
N$27
  Top 0.406: X4.2 55.24,11.43 54.61,12.06 54.61,16.82 R2_4.2 | X4.2 58.42,11.43 59.05,10.79 R3_4.2 | J4.2 56.9,7.24 56.52,7.62 X4.2
N$28
  Top 0.406: IC1_5.4 51.44,59.69 | 51.44,59.69 51.44,56.64 51.56,56.64 | 37.72,56.64 51.56,56.64 | IC1_7.4 24,56.39 SJ_2L_A.2 23.88,56.39 24.64,55.63 28.96,55.63 29.97,56.64 37.72,56.64 | IC1_6.4 37.72,56.64 | R8.2 53.76,59.69 51.44,59.69 | SJ_1L_A.2 55.12,56.39 54.86,56.64 51.56,56.64
N$29
  Top 0.406: R1_5.2 44.13,70.17 43.81,70.48 43.81,73.66 45.09,74.93 X5.2 46.35,74.93 46.99,75.56 R3_5.1 49.31,77.25 51.82,79.76 J5.3
N$30
  Top 0.406: R3_5.2 R2_5.2 | R2_5.2 52.86,75.4 R5.1 | R2_5.2 53.02,76.52 56.9,80.39 J5.2
N$31
  Top 0.406: 32.38,75.56 31.75,74.93 X6.2 29.84,74.93 28.57,73.66 28.57,69.85 29.21,69.22 R1_6.2 | 32.38,75.56 R3_6.1 | 32.38,75.56 32.38,76.2 36.58,80.39 J6.3
N$32
  Top 0.406: R2_6.2 37.78,76.52 41.66,80.39 J6.2 | R6.1 37.62,75.4 R2_6.2 | R3_6.2 R2_6.2
N$33
  Top 0.406: 17.14,75.56 16.51,74.93 X7.2 14.61,74.93 13.34,73.66 13.34,69.85 13.97,69.22 R1_7.2 | 17.14,75.56 R3_7.1 | 17.14,75.56 17.14,76.2 21.34,80.39 J7.3
N$34
  Top 0.406: R3_7.2 R2_7.2 | R7.1 22.38,75.4 R2_7.2 | R2_7.2 22.55,76.52 26.42,80.39 J7.2
N$35
  Top 0.406: R1_5.1 46.99,69.22 47.94,68.27 48.9,68.27 | 48.9,68.27 D1_5.2 | IC1_5.7 48.9,68.27
N$37
  Top 1.27: J8.3 6.1,78.99 6.35,78.74 D1.A
N$39
  Top 0.406: R51.1 51.4,50.8 48.26,50.8 46.99,49.53 LED1.A
N$40
  Top 0.406: R50.1 59.44,33.19 59.44,34.54 58.42,35.56 LED2.A
N$41
  Top 0.406: R2_5.1 54.92,70.48 | 54.92,70.48 54.92,68.89 53.34,67.31 50.8,67.31 50.16,66.67 IC1_5.6 | D1_5.1 49.84,70.17 50.16,70.48 54.92,70.48
N$43
  Top 0.406: R1_6.1 33.66,69.22 33.97,68.9 D1_6.2 35.18,68.79 IC1_6.7
N$47
  Top 0.406: R2_6.1 40.64,75.56 41.27,74.93 41.27,71.12 | 41.27,71.12 41.27,70.48 41.27,67.94 40.64,67.31 37.08,67.31 36.45,66.67 IC1_6.6 | D1_6.1 36.13,70.8 36.45,71.12 41.27,71.12
N$55
  Top 0.406: IC1_4.7 59.56,19.18 59.69,19.05 64.77,19.05 65.72,18.1 65.72,15.62 | 65.72,15.62 R1_4.1 | D1_4.2 65.66,15.56 65.72,15.62
N$59
  Top 0.406: R2_4.1 57.78,17.14 58.1,17.46 | 58.1,17.46 D1_4.1 | IC1_4.6 58.29,17.65 58.1,17.46
N$67
  Top 0.406: IC1_7.7 21.46,66.8 20.68,67.58 D1_7.2 | D1_7.2 18.73,68.9 18.41,69.22 R1_7.1 | D1_7.2
N$71
  Top 0.406: IC1_7.6 22.73,66.55 23.5,67.31 25.4,67.31 26.04,67.94 26.04,71.12 | 26.04,71.12 26.04,74.93 25.4,75.56 R2_7.1 | D1_7.1 21.27,70.8 21.59,71.12 26.04,71.12
V+
  Top 1.27: U$1.IN+.2 U$1.IN+.1 | IC10.1 21.08,39.12 U$1.IN+.1 | 6.1,48.51 C20.+ | C20.+ 6.35,47.75 | U$1.IN+.1 15.75,42.04 C21.2 13.95,42.69 11.43,45.21 9.4,45.21 C20.+ | D1.C C20.+

### Text on the board
tNames: RS485 Multi 6x | V0.1